# Altium schematic sheet design_9.SchDoc: design
size 414 x 279 mm; Date: 1/25/2021 11:39:22 PM; SheetNumber: 10; Origin: Eagle; GateName_1: G$1; SymbolName_1: A3-L-GUMSTIX; LibraryName: qualified_1; DeviceSetName: A3-L-GUMSTIX; A: A; B: B; C: C; D: D; E: E; F: F; G: G; H: H; 1: 1; 2: 2; 3: 3; 4: 4; 5: 5; Sheet: Sheet:; C:/Gumstix/gumstix-logo-16.bmp: C:/Gumstix/gumstix-logo-16.bmp; Board: Board:
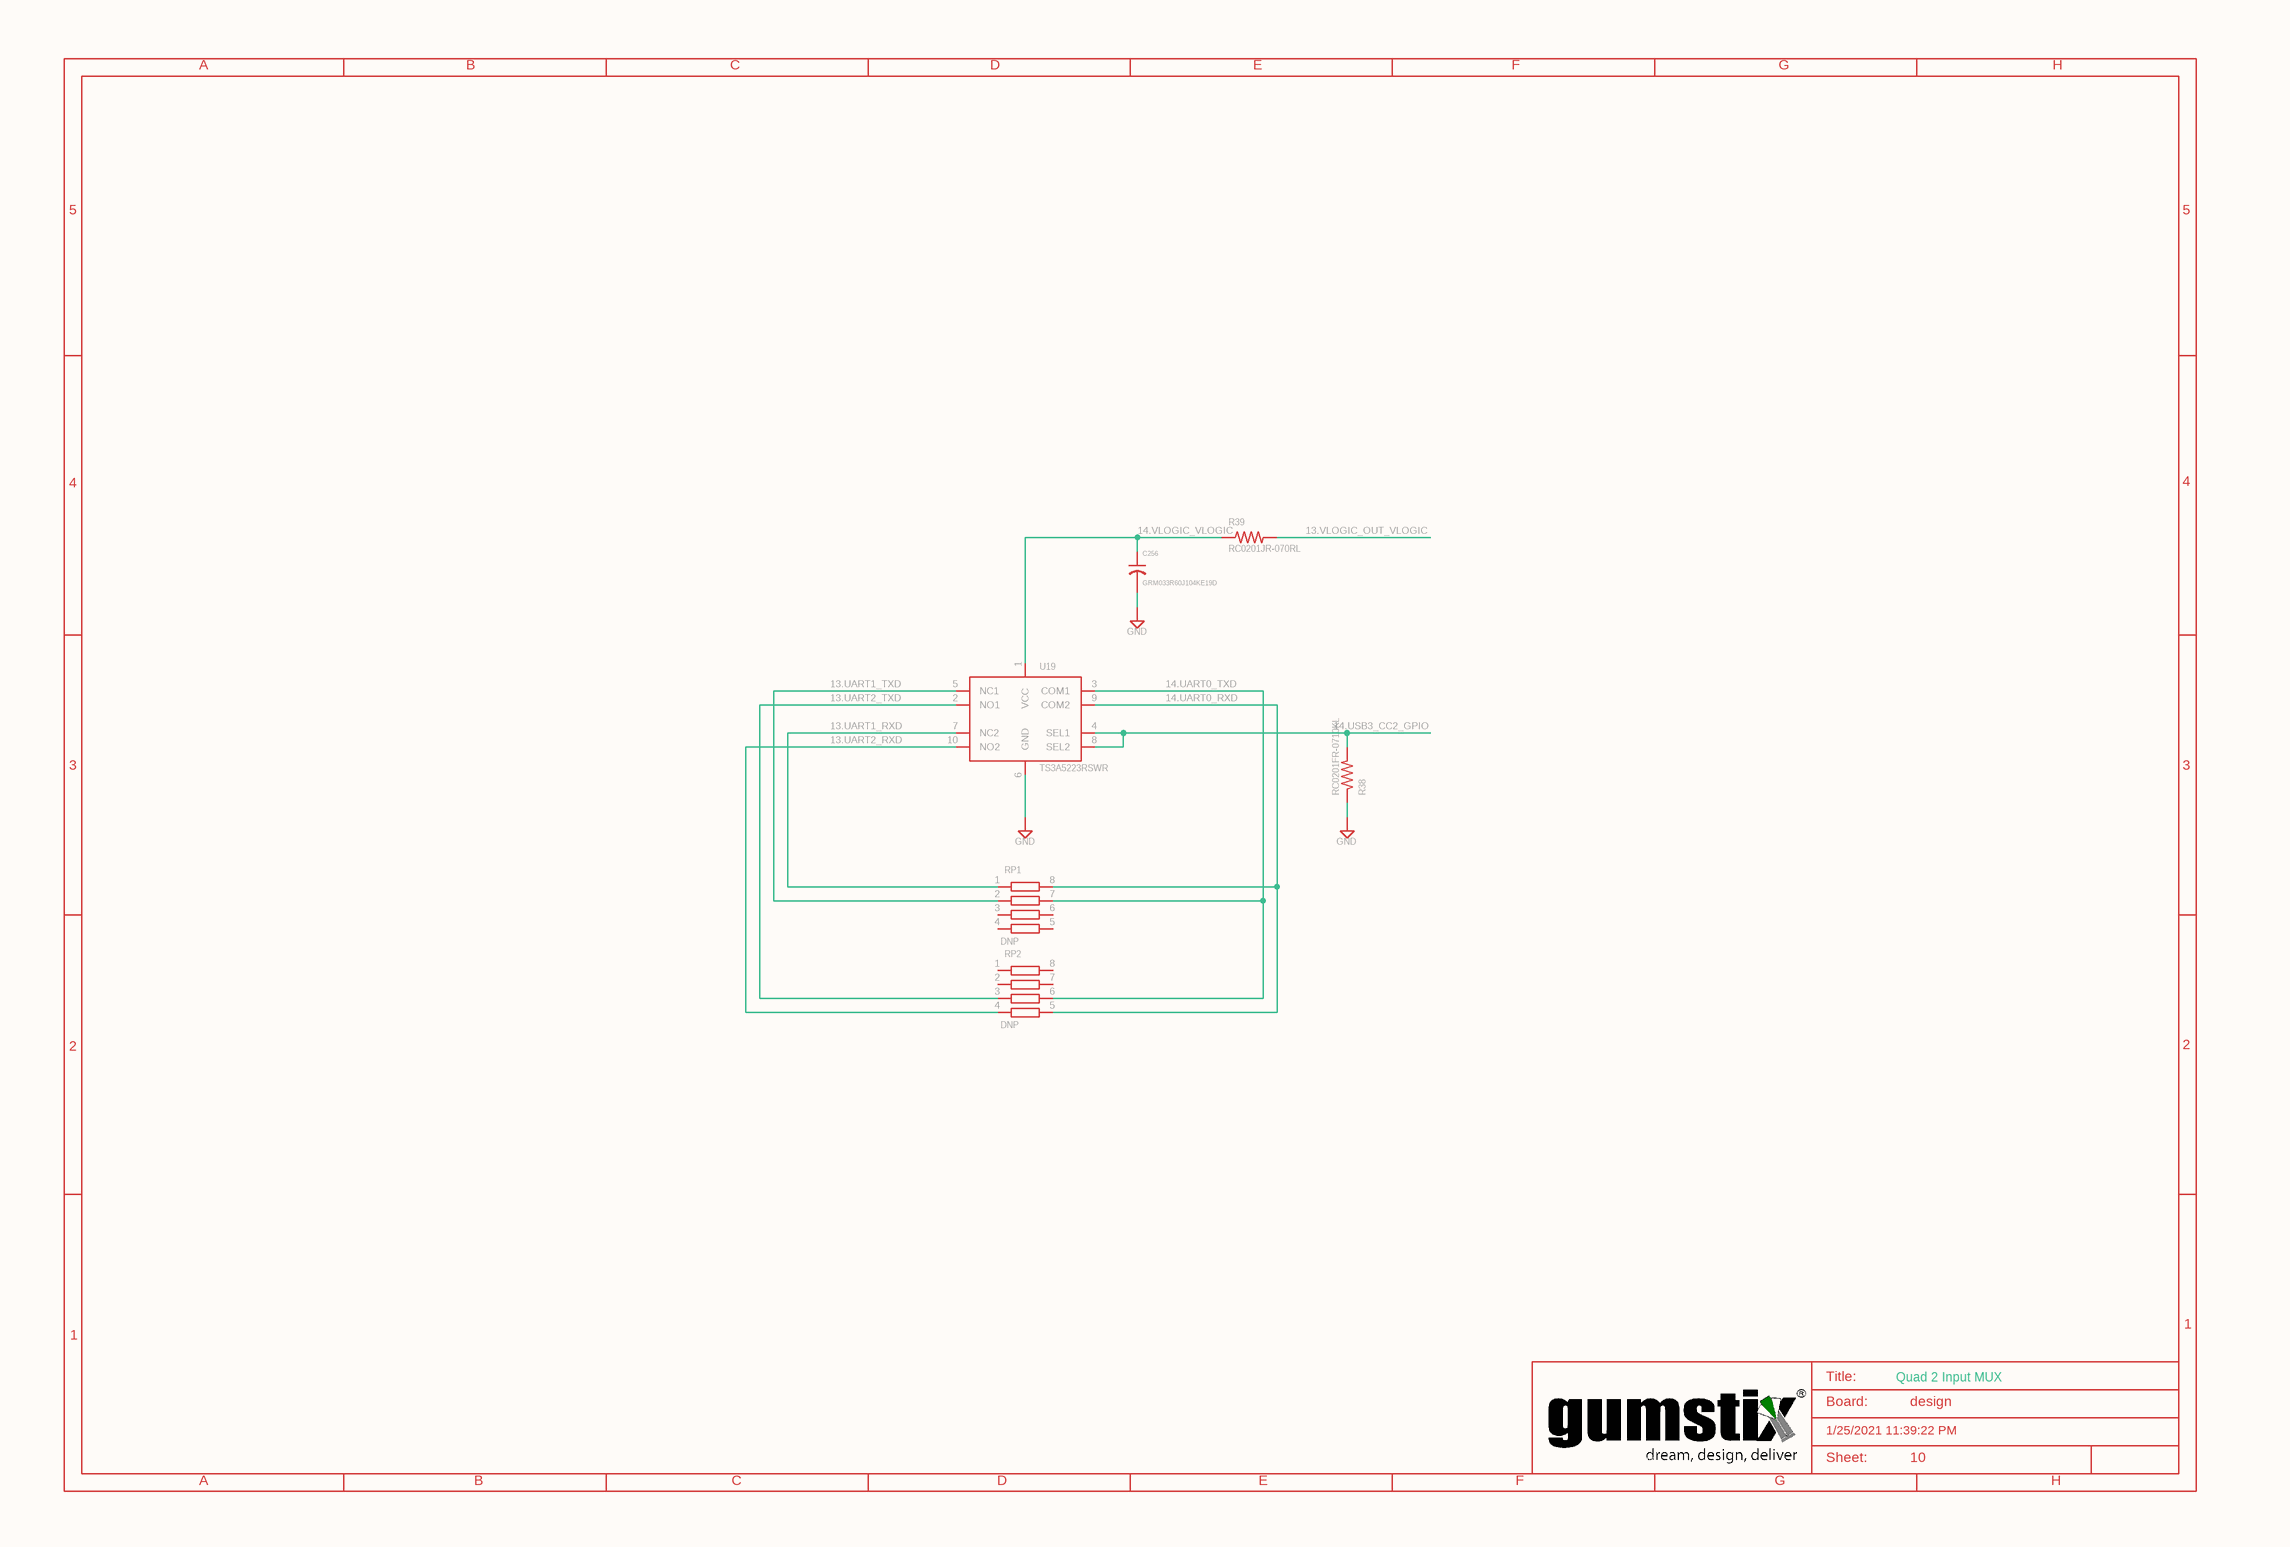
[diagram p0: design_9.SchDoc]

## Parts
C256  GRM033R60J104KE19D  [0201]
R38  RC0201FR-0710KL  [0201]
R39  RC0201JR-070RL  [0201]
RP1  DNP  [RP741X083]
RP2  DNP  [RP741X083]
SUPPLY108  GND
SUPPLY109  GND
SUPPLY110  GND
U19  TS3A5223RSWR  [UQFN-10]

## Nets
13.UART1_RXD: RP1.1 U19.7(NC2)
13.UART1_TXD: RP1.2 U19.5(NC1)
13.UART2_RXD: RP2.4 U19.10(NO2)
13.UART2_TXD: RP2.3 U19.2(NO1)
13.VLOGIC_OUT_VLOGIC: R39.2
14.UART0_RXD: RP1.8 RP2.5 U19.9(COM2)
14.UART0_TXD: RP1.7 RP2.6 U19.3(COM1)
14.USB3_CC2_GPIO: R38.2 U19.4(SEL1) U19.8(SEL2)
14.VLOGIC_VLOGIC: C256.1 R39.1 U19.1(VCC)
NetC256_2: C256.2 SUPPLY109.?1(GND)
NetR38_1: R38.1 SUPPLY110.?1(GND)
NetSUPPLY108_?1: SUPPLY108.?1(GND) U19.6(GND)

Not connected (* = marked no-connect by the designer): RP1 3 4 5 6; RP2 1 2 7 8

## Notes on the sheet
- A
- B
- C
- D
- E
- F
- G
- H
- 5
- 4
- 3
- 2
- 1
- Title:
- Board:
- Quad 2 Input MUX
- design
- C:/Gumstix/gumstix-logo-16.bmp
- 1/25/2021 11:39:22 PM
- Sheet:
- 10

## Library data of the parts
C256 = GRM033R60J104KE19D: GateName_1: G$1; SymbolName_1: C-US; LibraryName: qualified_1@eagle_src_repo_83354d0c2c11c8ce792d5cc032a7091e5ff73f00; DeviceSetName: GRM033R60J104KE19D; HEIGHT: 0.25
R38 = RC0201FR-0710KL: GateName_1: G$1; SymbolName_1: R-US; LibraryName: qualified_1@eagle_src_repo_83354d0c2c11c8ce792d5cc032a7091e5ff73f00; DeviceSetName: RC0201FR-0710KL; HEIGHT: 0.25
R39 = RC0201JR-070RL: GateName_1: G$1; SymbolName_1: R-US; LibraryName: qualified_1@eagle_src_repo_83354d0c2c11c8ce792d5cc032a7091e5ff73f00; DeviceSetName: RC0201JR-070RL; HEIGHT: 0.25
RP1 RP2 = RP741X083: GateName_1: G$1; SymbolName_1: RX04; LibraryName: qualified_1; DeviceSetName: RP741X083
SUPPLY108-SUPPLY110 = GND: SUPPLY SYMBOL; SymbolName_1: GND-2; GateName_1: GND; LibraryName: qualified_1; DeviceSetName: GND
U19 = TS3A5223RSWR: TS3A5223 0.45â„¦ Dual SPDT Bidirectional Analog Switch Package: UQFN-10  Source: http://www.ti.com/lit/ds/symlink/ts3a5223.pdf; GateName_1: G1; SymbolName_1: TS3A5223; LibraryName: qualified_1; DeviceSetName: TS3A5223RSWR